# Altium project Vanodent.PrjPcb
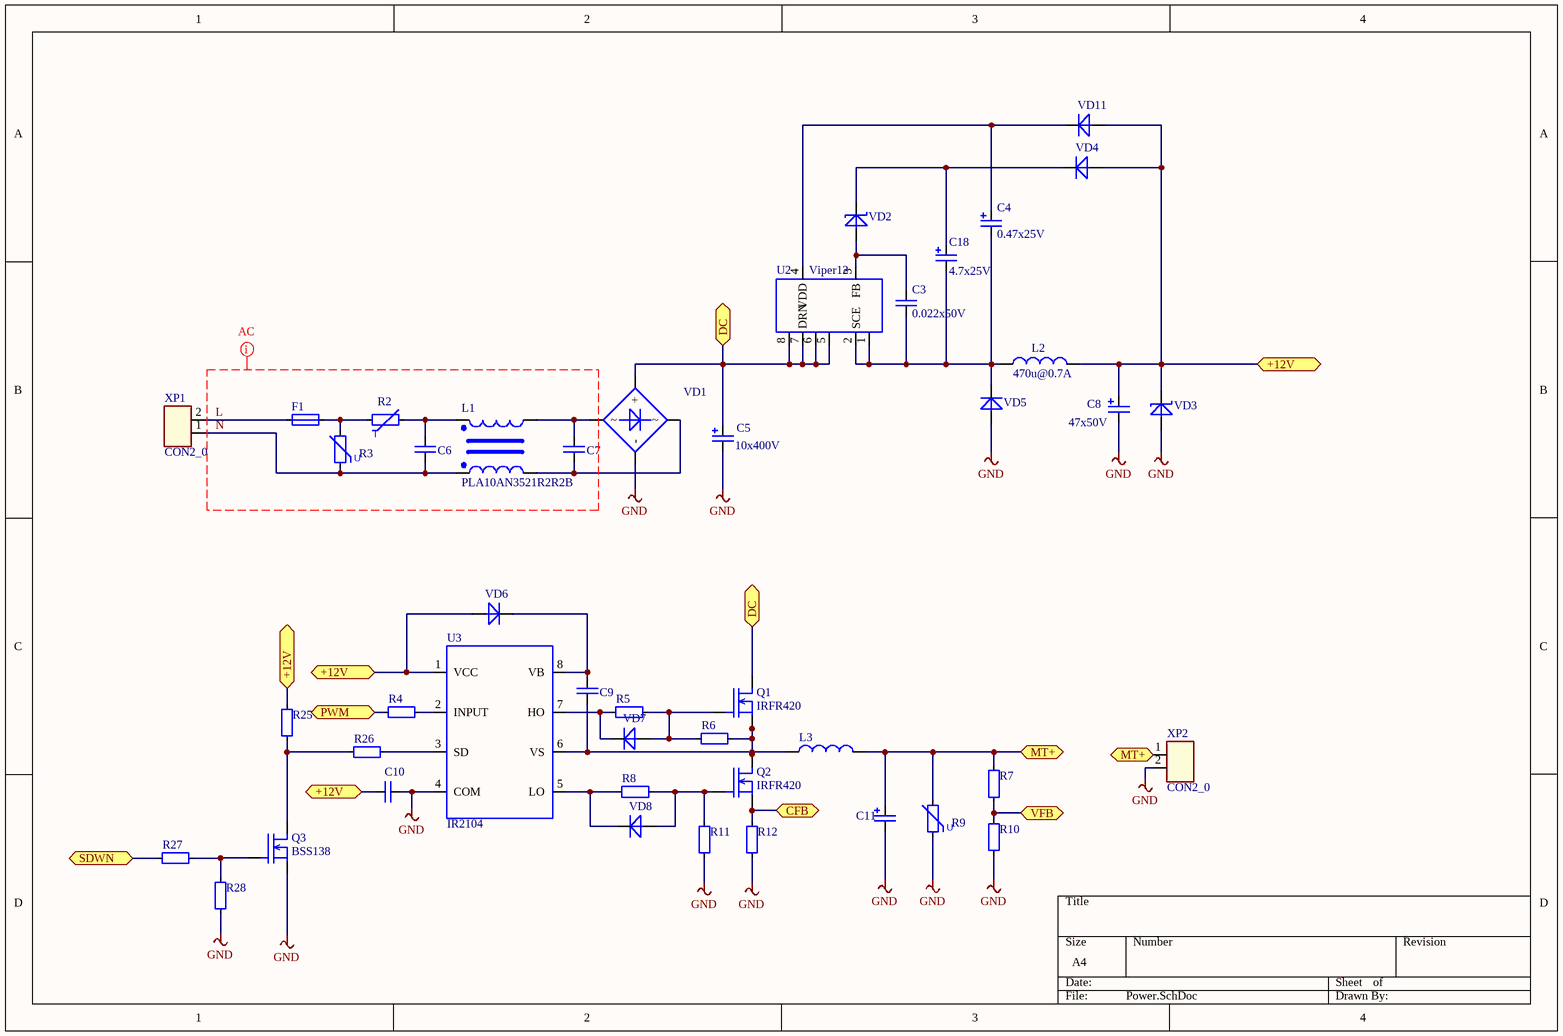
[diagram p0: Power.SchDoc]
3 sheets, 76 parts. Net scope: flat (ports and power ports of the same name join across sheets).
Board file: PCB.PcbDoc
Sheets:
  Power.SchDoc
  MCU.SchDoc
  PWM.SchDoc

## Sheet Power.SchDoc
size A4

### Parts
C3  0.022x50V  [SMD_0805]
C4  0.47x25V  [CAPR-5/2.5]
C5  10x400V  [CAPR-10/5]
C6  (no value)  [MKR-X2-0.22-10]
C7  (no value)  [MKR-X2-0.22-10]
C8  47x50V  [CAPR-5/2.5]
C9  (no value)  [SMD_0805]
C10  (no value)  [SMD_0805]
C11  (no value)  [CAPR-5/2.5]
C18  4.7x25V  [CAPR-5/2.5]
F1  (no value)  [KLS-1009]
L1  PLA10AN3521R2R2B  [PLA10AN3521R2R2B]
L2  470u@0.7A  [IND-DV0470.00K]
L3  (no value)  [IND-DV0470.00K]
Q1  IRFR420  [TO-252]
Q2  IRFR420  [TO-252]
Q3  BSS138  [SOT23-3PIN]
R2  RES NTC  [NTC-5mm]  (value not drawn)
R3  RES VARISTOR  [VAR-10D]  (value not drawn)
R4  (no value)  [SMD_0805]
R5  (no value)  [SMD_0805]
R6  (no value)  [SMD_0805]
R7  (no value)  [SMD_0805]
R8  (no value)  [SMD_0805]
R9  RES VARISTOR  [VAR-05D]  (value not drawn)
R10  (no value)  [SMD_0805]
R11  (no value)  [SMD_0805]
R12  (no value)  [SMD_0805]
R25  (no value)  [SMD_0805]
R26  (no value)  [SMD_0805]
R27  (no value)  [SMD_0805]
R28  (no value)  [SMD_0805]
U2  Viper12  [SO8-150mil]
U3  IR2104  [SO8-150mil]
VD1  DIODE BRIDGE  [GBU BRIDGE]  (value not drawn)
VD2  (no value)  [SOD-123]
VD3  (no value)  [SOD-123]
VD4  (no value)  [DO214-AC]
VD5  (no value)  [DO214-AC]
VD6  (no value)  [DO214-AC]
VD7  (no value)  [DIO-MELF_SOD-80]
VD8  (no value)  [DIO-MELF_SOD-80]
VD11  (no value)  [DO214-AC]
XP1  CON2_0  [SCREW_TERM-5.0/2]
XP2  CON2_0  [SCREW_TERM-5.0/2]

### Ports
+12V, CFB, DC, MT+, PWM, SDWN, VFB

### Nets
+12V: C8.1 C10.1 L2.2 R25.2 U3.1(VCC) VD3.1(C) VD4.2(A) VD6.2(A) VD11.2(A) ; port +12V
GND: C5.2 C8.2 C10.2 C11.2 Q3.2(S) R9.1 R10.1 R11.2 R12.2 R28.1 U3.4(COM) VD1.4(-) VD3.2(A) VD5.2(A) XP2.2
L: F1.2 XP1.2
N: C6.2 L1.1 R3.1 XP1.1
SDWN: R27.2 ; port SDWN
NetC3_1: C3.1 U2.3(FB) VD2.2(A)
NetC3_2: C3.2 C4.2 C18.2 L2.1 U2.1(SCE) U2.2(SCE) VD5.1(C)
NetC4_1: C4.1 U2.4(VDD) VD11.1(C)
NetC5_1: C5.1 Q1.2(S) U2.5(DRN) U2.6(DRN) U2.7(DRN) U2.8(DRN) VD1.1(+) ; port DC
NetC6_1: C6.1 L1.4 R2.2
NetC7_1: C7.1 L1.3 VD1.2
NetC7_2: C7.2 L1.2 VD1.3
NetC9_1: C9.1 U3.8(VB) VD6.1(C)
NetC9_2: C9.2 L3.1 Q1.3(D) Q2.2(S) R6.2 U3.6(VS)
NetC11_1: C11.1 L3.2 R7.2 R9.2 XP2.1 ; port MT+
NetC13_2: R7.1 R10.2 ; port VFB
NetC18_1: C18.1 VD2.1(C) VD4.1(C)
NetF1_1: F1.1 R2.1 R3.2
NetQ1_1: Q1.1(G) R5.1 R6.1 VD7.2(A)
NetQ2_1: Q2.1(G) R8.1 R11.1 VD8.2(A)
NetQ2_3: Q2.3(D) R12.1 ; port CFB
NetQ3_1: Q3.1(G) R27.1 R28.2
NetQ3_3: Q3.3(D) R25.1 R26.1
NetR4_1: R4.1 ; port PWM
NetR4_2: R4.2 U3.2(INPUT)
NetR5_2: R5.2 U3.7(HO) VD7.1(C)
NetR8_2: R8.2 U3.5(LO) VD8.1(C)
NetR26_2: R26.2 U3.3(SD)

### Layout directives
AC Input: Undefined: L, N

### Notes on the sheet
- (in symbol RES NTC) T
- (in symbol RES VARISTOR) U

### Library data of the parts
C3 C6 C7 C9 C10 = C_NONE_POLAR: None polar capacitor
  C3: Value: 0.022x50V
C4 C5 C8 C11 C18 = C_POLAR: Polar capacitor
  C4: Value: 0.47x25V
  C5: Value: 10x400V
  C8: Value: 47x50V
  C18: Value: 4.7x25V
F1 = FUSE: Resistor
L1 = Inductor Sin
L2 L3 = INDUCTOR
  L2: Value: 470u@0.7A
Q1 Q2 = IRFR420: IG-FET N-Channel; Manufacture: Vishay; Model: IRFR420; HelpURL: https://www.rcscomponents.com/datasheets/irfr420pbf.pdf; Case: TO-252
Q3 = BSS138: IG-FET N-Channel; Manufacture: Fairchild; Model: BSS138; HelpURL: https://cdn.sparkfun.com/datasheets/BreakoutBoards/BSS138.pdf; Case: SOT-23
R4-R8 R10-R12 R25-R28 = RES: Resistor
U2 = Viper12: Step-Down Converter; Manufacturer: STMicro; Model: Viper12-A; HelpURL: http://www.st.com/content/st_com/en/products/power-management/ac-dc-converters/high-voltage-converters/viper/viper12a-e.html
VD2 VD3 = ZENER: Zener diode
VD4-VD8 VD11 = DIODE: Case: *

## Sheet MCU.SchDoc
size A4
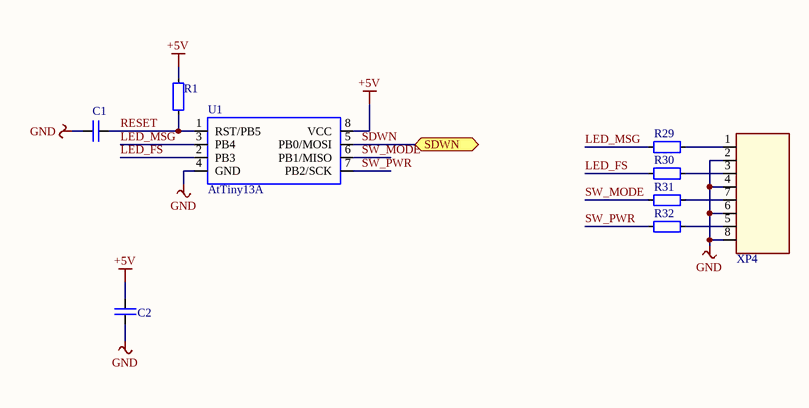
[diagram p1: MCU.SchDoc]

### Parts
C1  (no value)  [SMD_0805]
C2  (no value)  [SMD_0805]
R1  (no value)  [SMD_0805]
R29  (no value)  [SMD_0805]
R30  (no value)  [SMD_0805]
R31  (no value)  [SMD_0805]
R32  (no value)  [SMD_0805]
U1  AtTiny13A  [SO8-150mil]
XP4  CON_8  [HEAD-1/8/2.54]  (value not drawn)

### Ports
SDWN

### Nets
+5V: C2.1 R1.2 U1.8(VCC)
GND: C1.1 C2.2 U1.4(GND) XP4.2 XP4.4 XP4.6 XP4.8
LED_FS: R30.2 U1.2(PB3)
LED_MSG: R29.2 U1.3(PB4)
RESET: C1.2 R1.1 U1.1(RST/PB5)
SDWN: U1.5(PB0/MOSI) ; port SDWN
SW_MODE: R31.2 U1.6(PB1/MISO)
SW_PWR: R32.2 U1.7(PB2/SCK)
NetR29_1: R29.1 XP4.1
NetR30_1: R30.1 XP4.3
NetR31_1: R31.1 XP4.7
NetR32_1: R32.1 XP4.5

### Library data of the parts
C1 C2 = C_NONE_POLAR: None polar capacitor
R1 R29-R32 = RES: Resistor

## Sheet PWM.SchDoc
size A4
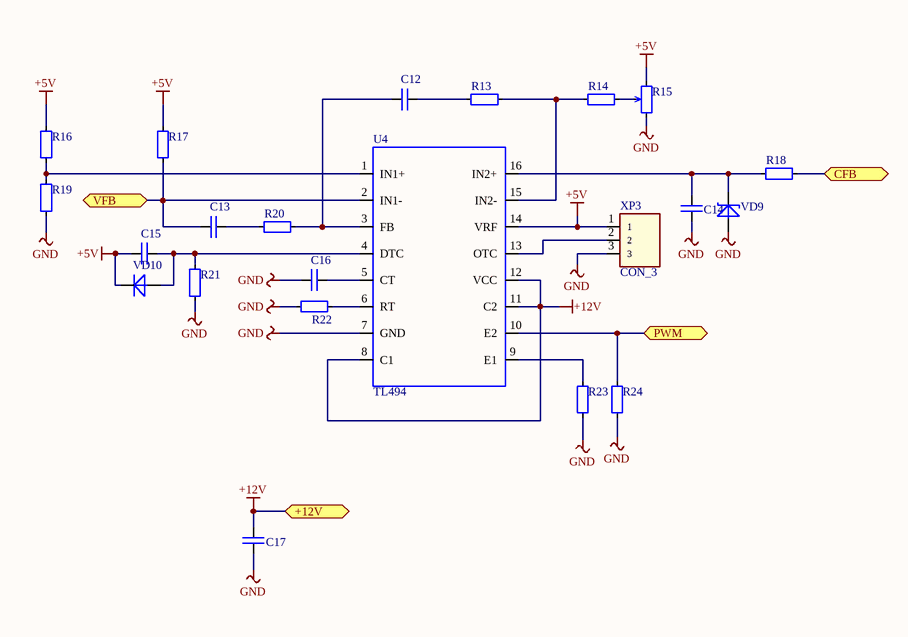
[diagram p2: PWM.SchDoc]

### Parts
C12  (no value)  [SMD_0805]
C13  (no value)  [SMD_0805]
C14  (no value)  [SMD_0805]
C15  (no value)  [SMD_1206]
C16  (no value)  [SMD_0805]
C17  (no value)  [SMD_0805]
R13  (no value)  [SMD_0805]
R14  (no value)  [SMD_0805]
R15  (no value)  [HEAD-1/3/2.54]
R16  (no value)  [SMD_0805]
R17  (no value)  [SMD_0805]
R18  (no value)  [SMD_0805]
R19  (no value)  [SMD_0805]
R20  (no value)  [SMD_0805]
R21  (no value)  [SMD_0805]
R22  (no value)  [SMD_0805]
R23  (no value)  [SMD_0805]
R24  (no value)  [SMD_0805]
U4  TL494  [SOIC-16]
VD9  (no value)  [SOD-123]
VD10  (no value)  [DIO-MELF_SOD-80]
XP3  CON_3  [HEAD-1/3/2.54]

### Ports
+12V, CFB, PWM, VFB

### Nets
+5V: C15.2 R15.2 R16.2 R17.2 U4.14(VRF) VD10.1(C) XP3.1
+12V: C17.1 U4.8(C1) U4.11(C2) U4.12(VCC) ; port +12V
GND: C14.1 C16.2 C17.2 R15.1 R19.1 R21.2 R22.2 R23.2 R24.2 U4.7(GND) VD9.2(A) XP3.3
NetC12_1: C12.1 R13.2
NetC12_2: C12.2 R20.1 U4.3(FB)
NetC13_1: C13.1 R20.2
NetC13_2: C13.2 R17.1 U4.2(IN1-) ; port VFB
NetC14_2: C14.2 R18.1 U4.16(IN2+) VD9.1(C)
NetC15_1: C15.1 R21.1 U4.4(DTC) VD10.2(A)
NetC16_1: C16.1 U4.5(CT)
NetQ2_3: R18.2 ; port CFB
NetR4_1: R24.1 U4.10(E2) ; port PWM
NetR13_1: R13.1 R14.2 U4.15(IN2-)
NetR14_1: R14.1 R15.3
NetR16_1: R16.1 R19.2 U4.1(IN1+)
NetR22_1: R22.1 U4.6(RT)
NetR23_1: R23.1 U4.9(E1)
NetU4_13: U4.13(OTC) XP3.2

### Library data of the parts
C12-C17 = C_NONE_POLAR: None polar capacitor
R13 R14 R16-R24 = RES: Resistor
R15 = RES_ADJ: Agjustable resistor
U4 = TL494: PWM controller
VD9 = ZENER: Zener diode
VD10 = DIODE: Case: *

## Nets that join several sheets
+5V: MCU (C2.1 R1.2 U1.8), PWM (7 pins)
+12V: Power (9 pins), PWM (C17.1 U4.8 U4.11 U4.12)
GND: Power (15 pins), MCU (7 pins), PWM (12 pins)
NetC13_2: Power (R7.1 R10.2), PWM (C13.2 R17.1 U4.2)
NetQ2_3: Power (Q2.3 R12.1), PWM (R18.2)
NetR4_1: Power (R4.1), PWM (R24.1 U4.10)
SDWN: Power (R27.2), MCU (U1.5)